# Altium schematic sheet Fsociety_Keyboard_SCH_Cherry.SchDoc: NEW DESIGN
size A2; CompanyName: Rena Electronica; Engineer: IK; Organization: Rena Electronica; Address1: de Ambachten 12; Address2: 4881 XZ; Address3: Zundert; Address4: the Netherlands; DocumentNumber: 05.xxx; Revision: 0.10; Customer: Klantnaam; PageSetup: Record=PageOptions|CenterHorizontal=True|CenterVertical=True|PrintScale=0.73|XCorrection=1.00|YCorrection=1.00|PrintKind=0|BorderSize=5000000|LeftOffset=0|BottomOffset=0|Orientation=2|PaperLength=1000|PaperWidth=1000|Scale=100|PaperSource=7|PrintQuality=-3|MediaType=1|DitherType=10|PrintScaleMode=1|PaperKind=A3|PaperIndex=8; ProjectName: R_NAAM.PRJ
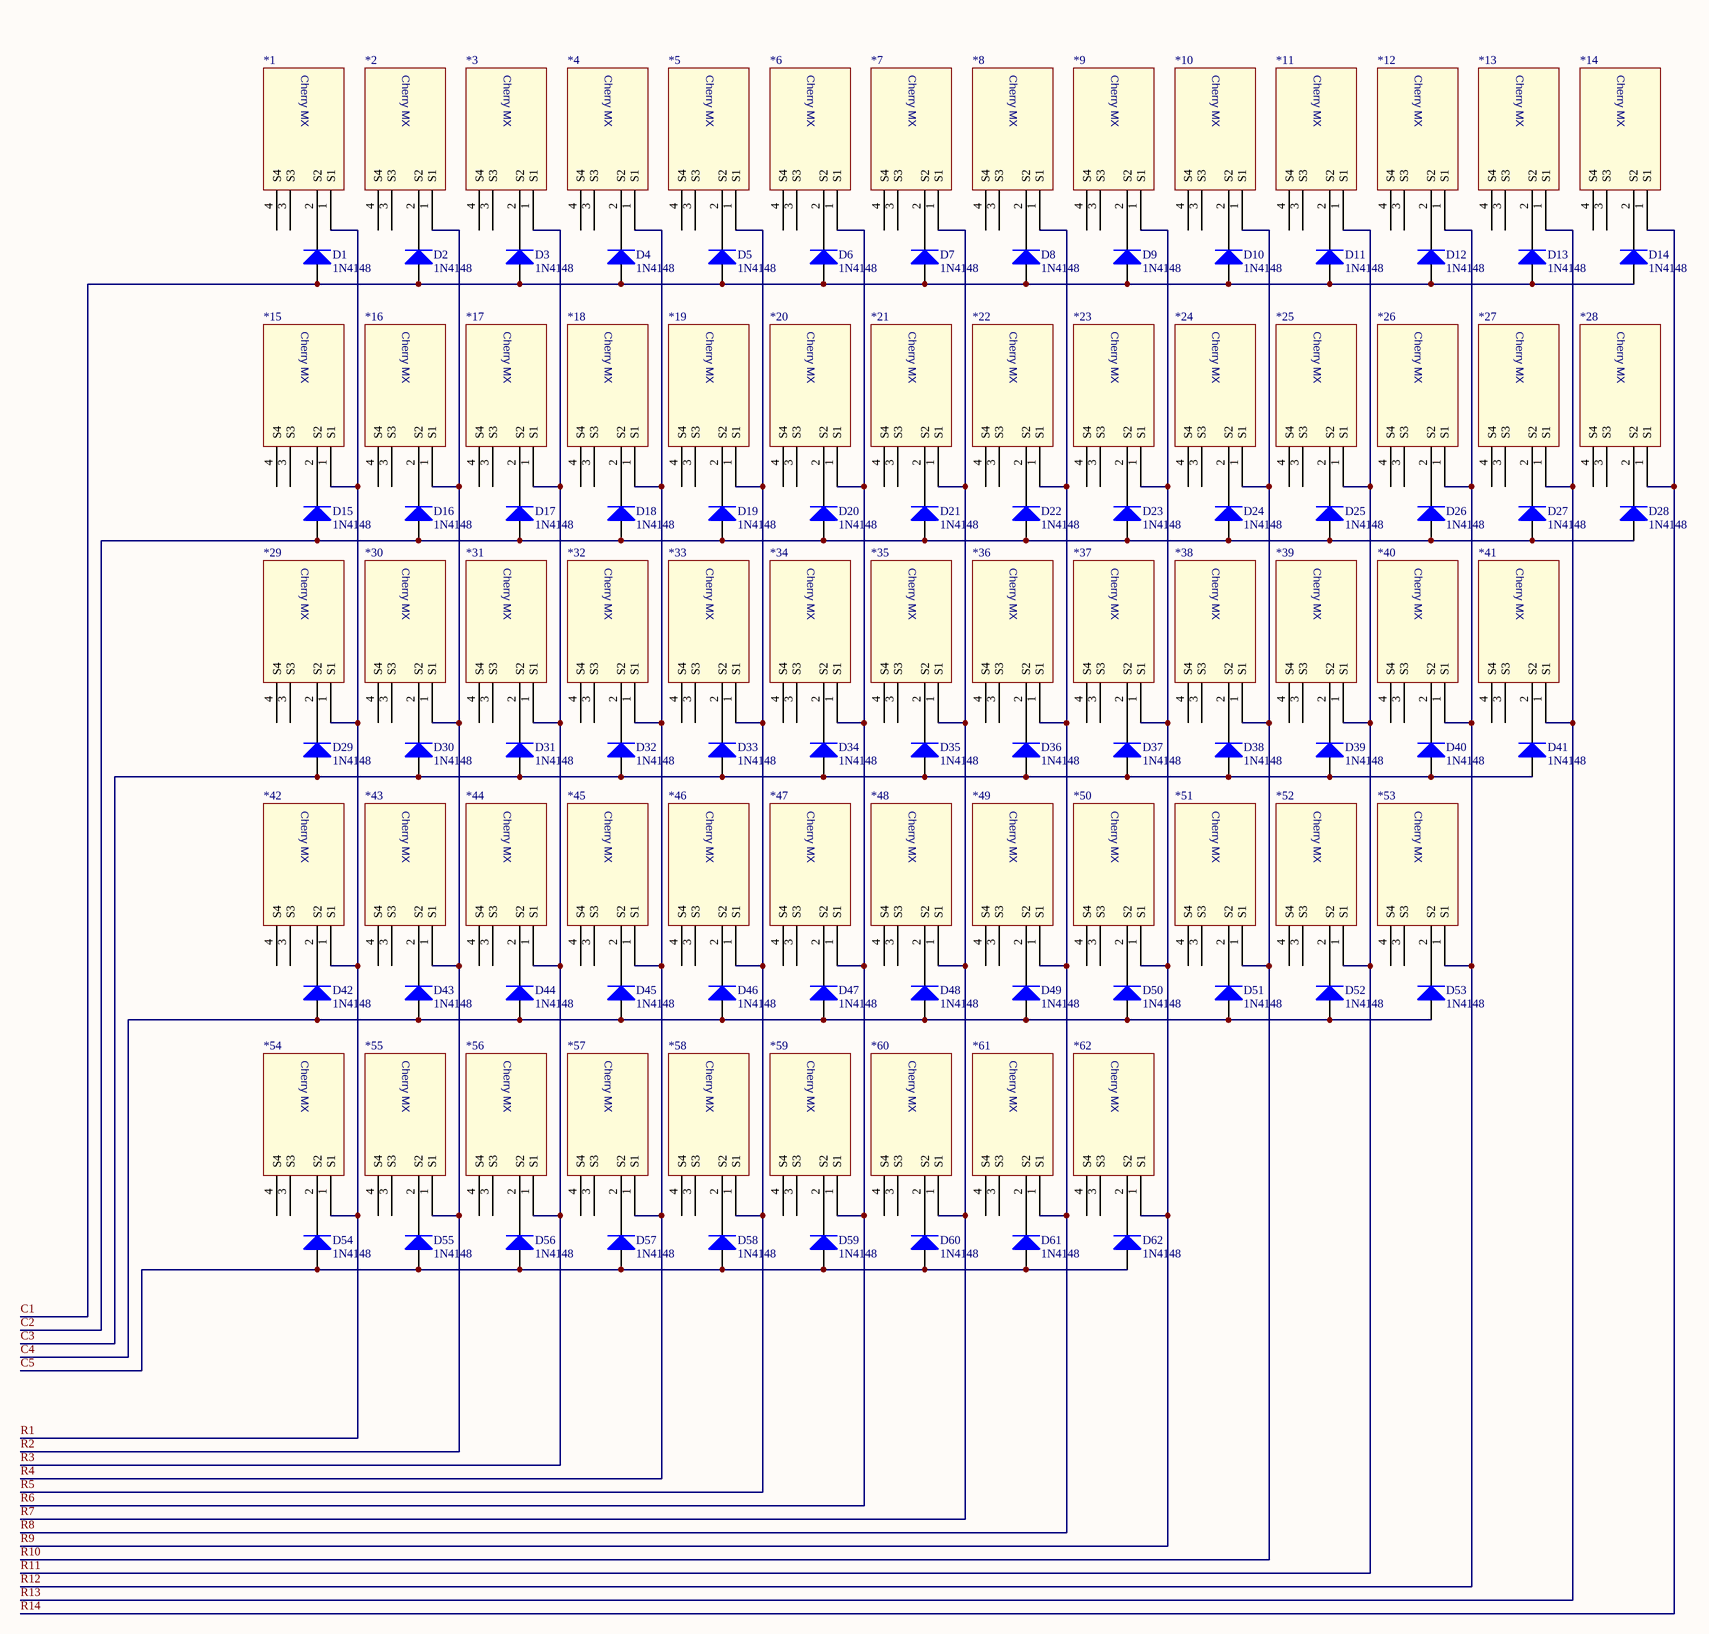
[diagram p0: Fsociety_Keyboard_SCH_Cherry.SchDoc]

## Parts
*1  CHERRY_MX  [CherryMX]  (value not drawn)
*2  CHERRY_MX  [CherryMX]  (value not drawn)
*3  CHERRY_MX  [CherryMX]  (value not drawn)
*4  CHERRY_MX  [CherryMX]  (value not drawn)
*5  CHERRY_MX  [CherryMX]  (value not drawn)
*6  CHERRY_MX  [CherryMX]  (value not drawn)
*7  CHERRY_MX  [CherryMX]  (value not drawn)
*8  CHERRY_MX  [CherryMX]  (value not drawn)
*9  CHERRY_MX  [CherryMX]  (value not drawn)
*10  CHERRY_MX  [CherryMX]  (value not drawn)
*11  CHERRY_MX  [CherryMX]  (value not drawn)
*12  CHERRY_MX  [CherryMX]  (value not drawn)
*13  CHERRY_MX  [CherryMX]  (value not drawn)
*14  CHERRY_MX  [CherryMX]  (value not drawn)
*15  CHERRY_MX  [CherryMX]  (value not drawn)
*16  CHERRY_MX  [CherryMX]  (value not drawn)
*17  CHERRY_MX  [CherryMX]  (value not drawn)
*18  CHERRY_MX  [CherryMX]  (value not drawn)
*19  CHERRY_MX  [CherryMX]  (value not drawn)
*20  CHERRY_MX  [CherryMX]  (value not drawn)
*21  CHERRY_MX  [CherryMX]  (value not drawn)
*22  CHERRY_MX  [CherryMX]  (value not drawn)
*23  CHERRY_MX  [CherryMX]  (value not drawn)
*24  CHERRY_MX  [CherryMX]  (value not drawn)
*25  CHERRY_MX  [CherryMX]  (value not drawn)
*26  CHERRY_MX  [CherryMX]  (value not drawn)
*27  CHERRY_MX  [CherryMX]  (value not drawn)
*28  CHERRY_MX  [CherryMX]  (value not drawn)
*29  CHERRY_MX  [CherryMX]  (value not drawn)
*30  CHERRY_MX  [CherryMX]  (value not drawn)
*31  CHERRY_MX  [CherryMX]  (value not drawn)
*32  CHERRY_MX  [CherryMX]  (value not drawn)
*33  CHERRY_MX  [CherryMX]  (value not drawn)
*34  CHERRY_MX  [CherryMX]  (value not drawn)
*35  CHERRY_MX  [CherryMX]  (value not drawn)
*36  CHERRY_MX  [CherryMX]  (value not drawn)
*37  CHERRY_MX  [CherryMX]  (value not drawn)
*38  CHERRY_MX  [CherryMX]  (value not drawn)
*39  CHERRY_MX  [CherryMX]  (value not drawn)
*40  CHERRY_MX  [CherryMX]  (value not drawn)
*41  CHERRY_MX  [CherryMX]  (value not drawn)
*42  CHERRY_MX  [CherryMX]  (value not drawn)
*43  CHERRY_MX  [CherryMX]  (value not drawn)
*44  CHERRY_MX  [CherryMX]  (value not drawn)
*45  CHERRY_MX  [CherryMX]  (value not drawn)
*46  CHERRY_MX  [CherryMX]  (value not drawn)
*47  CHERRY_MX  [CherryMX]  (value not drawn)
*48  CHERRY_MX  [CherryMX]  (value not drawn)
*49  CHERRY_MX  [CherryMX]  (value not drawn)
*50  CHERRY_MX  [CherryMX]  (value not drawn)
*51  CHERRY_MX  [CherryMX]  (value not drawn)
*52  CHERRY_MX  [CherryMX]  (value not drawn)
*53  CHERRY_MX  [CherryMX]  (value not drawn)
*54  CHERRY_MX  [CherryMX]  (value not drawn)
*55  CHERRY_MX  [CherryMX]  (value not drawn)
*56  CHERRY_MX  [CherryMX]  (value not drawn)
*57  CHERRY_MX  [CherryMX]  (value not drawn)
*58  CHERRY_MX  [CherryMX]  (value not drawn)
*59  CHERRY_MX  [CherryMX]  (value not drawn)
*60  CHERRY_MX  [CherryMX]  (value not drawn)
*61  CHERRY_MX  [CherryMX]  (value not drawn)
*62  CHERRY_MX  [CherryMX]  (value not drawn)
D1  1N4148  [DIOMELF3515_NR_SOD80C]
D2  1N4148  [DIOMELF3515_NR_SOD80C]
D3  1N4148  [DIOMELF3515_NR_SOD80C]
D4  1N4148  [DIOMELF3515_NR_SOD80C]
D5  1N4148  [DIOMELF3515_NR_SOD80C]
D6  1N4148  [DIOMELF3515_NR_SOD80C]
D7  1N4148  [DIOMELF3515_NR_SOD80C]
D8  1N4148  [DIOMELF3515_NR_SOD80C]
D9  1N4148  [DIOMELF3515_NR_SOD80C]
D10  1N4148  [DIOMELF3515_NR_SOD80C]
D11  1N4148  [DIOMELF3515_NR_SOD80C]
D12  1N4148  [DIOMELF3515_NR_SOD80C]
D13  1N4148  [DIOMELF3515_NR_SOD80C]
D14  1N4148  [DIOMELF3515_NR_SOD80C]
D15  1N4148  [DIOMELF3515_NR_SOD80C]
D16  1N4148  [DIOMELF3515_NR_SOD80C]
D17  1N4148  [DIOMELF3515_NR_SOD80C]
D18  1N4148  [DIOMELF3515_NR_SOD80C]
D19  1N4148  [DIOMELF3515_NR_SOD80C]
D20  1N4148  [DIOMELF3515_NR_SOD80C]
D21  1N4148  [DIOMELF3515_NR_SOD80C]
D22  1N4148  [DIOMELF3515_NR_SOD80C]
D23  1N4148  [DIOMELF3515_NR_SOD80C]
D24  1N4148  [DIOMELF3515_NR_SOD80C]
D25  1N4148  [DIOMELF3515_NR_SOD80C]
D26  1N4148  [DIOMELF3515_NR_SOD80C]
D27  1N4148  [DIOMELF3515_NR_SOD80C]
D28  1N4148  [DIOMELF3515_NR_SOD80C]
D29  1N4148  [DIOMELF3515_NR_SOD80C]
D30  1N4148  [DIOMELF3515_NR_SOD80C]
D31  1N4148  [DIOMELF3515_NR_SOD80C]
D32  1N4148  [DIOMELF3515_NR_SOD80C]
D33  1N4148  [DIOMELF3515_NR_SOD80C]
D34  1N4148  [DIOMELF3515_NR_SOD80C]
D35  1N4148  [DIOMELF3515_NR_SOD80C]
D36  1N4148  [DIOMELF3515_NR_SOD80C]
D37  1N4148  [DIOMELF3515_NR_SOD80C]
D38  1N4148  [DIOMELF3515_NR_SOD80C]
D39  1N4148  [DIOMELF3515_NR_SOD80C]
D40  1N4148  [DIOMELF3515_NR_SOD80C]
D41  1N4148  [DIOMELF3515_NR_SOD80C]
D42  1N4148  [DIOMELF3515_NR_SOD80C]
D43  1N4148  [DIOMELF3515_NR_SOD80C]
D44  1N4148  [DIOMELF3515_NR_SOD80C]
D45  1N4148  [DIOMELF3515_NR_SOD80C]
D46  1N4148  [DIOMELF3515_NR_SOD80C]
D47  1N4148  [DIOMELF3515_NR_SOD80C]
D48  1N4148  [DIOMELF3515_NR_SOD80C]
D49  1N4148  [DIOMELF3515_NR_SOD80C]
D50  1N4148  [DIOMELF3515_NR_SOD80C]
D51  1N4148  [DIOMELF3515_NR_SOD80C]
D52  1N4148  [DIOMELF3515_NR_SOD80C]
D53  1N4148  [DIOMELF3515_NR_SOD80C]
D54  1N4148  [DIOMELF3515_NR_SOD80C]
D55  1N4148  [DIOMELF3515_NR_SOD80C]
D56  1N4148  [DIOMELF3515_NR_SOD80C]
D57  1N4148  [DIOMELF3515_NR_SOD80C]
D58  1N4148  [DIOMELF3515_NR_SOD80C]
D59  1N4148  [DIOMELF3515_NR_SOD80C]
D60  1N4148  [DIOMELF3515_NR_SOD80C]
D61  1N4148  [DIOMELF3515_NR_SOD80C]
D62  1N4148  [DIOMELF3515_NR_SOD80C]

## Nets
C1: D1.A D2.A D3.A D4.A D5.A D6.A D7.A D8.A D9.A D10.A D11.A D12.A D13.A D14.A
C2: D15.A D16.A D17.A D18.A D19.A D20.A D21.A D22.A D23.A D24.A D25.A D26.A D27.A D28.A
C3: D29.A D30.A D31.A D32.A D33.A D34.A D35.A D36.A D37.A D38.A D39.A D40.A D41.A
C4: D42.A D43.A D44.A D45.A D46.A D47.A D48.A D49.A D50.A D51.A D52.A D53.A
C5: D54.A D55.A D56.A D57.A D58.A D59.A D60.A D61.A D62.A
R1: *1.1(S1) *15.1(S1) *29.1(S1) *42.1(S1) *54.1(S1)
R2: *2.1(S1) *16.1(S1) *30.1(S1) *43.1(S1) *55.1(S1)
R3: *3.1(S1) *17.1(S1) *31.1(S1) *44.1(S1) *56.1(S1)
R4: *4.1(S1) *18.1(S1) *32.1(S1) *45.1(S1) *57.1(S1)
R5: *5.1(S1) *19.1(S1) *33.1(S1) *46.1(S1) *58.1(S1)
R6: *6.1(S1) *20.1(S1) *34.1(S1) *47.1(S1) *59.1(S1)
R7: *7.1(S1) *21.1(S1) *35.1(S1) *48.1(S1) *60.1(S1)
R8: *8.1(S1) *22.1(S1) *36.1(S1) *49.1(S1) *61.1(S1)
R9: *9.1(S1) *23.1(S1) *37.1(S1) *50.1(S1) *62.1(S1)
R10: *10.1(S1) *24.1(S1) *38.1(S1) *51.1(S1)
R11: *11.1(S1) *25.1(S1) *39.1(S1) *52.1(S1)
R12: *12.1(S1) *26.1(S1) *40.1(S1) *53.1(S1)
R13: *13.1(S1) *27.1(S1) *41.1(S1)
R14: *14.1(S1) *28.1(S1)
Net*1_2: *1.2(S2) D1.C
Net*2_2: *2.2(S2) D2.C
Net*3_2: *3.2(S2) D3.C
Net*4_2: *4.2(S2) D4.C
Net*5_2: *5.2(S2) D5.C
Net*6_2: *6.2(S2) D6.C
Net*7_2: *7.2(S2) D7.C
Net*8_2: *8.2(S2) D8.C
Net*9_2: *9.2(S2) D9.C
Net*10_2: *10.2(S2) D10.C
Net*11_2: *11.2(S2) D11.C
Net*12_2: *12.2(S2) D12.C
Net*13_2: *13.2(S2) D13.C
Net*14_2: *14.2(S2) D14.C
Net*15_2: *15.2(S2) D15.C
Net*16_2: *16.2(S2) D16.C
Net*17_2: *17.2(S2) D17.C
Net*18_2: *18.2(S2) D18.C
Net*19_2: *19.2(S2) D19.C
Net*20_2: *20.2(S2) D20.C
Net*21_2: *21.2(S2) D21.C
Net*22_2: *22.2(S2) D22.C
Net*23_2: *23.2(S2) D23.C
Net*24_2: *24.2(S2) D24.C
Net*25_2: *25.2(S2) D25.C
Net*26_2: *26.2(S2) D26.C
Net*27_2: *27.2(S2) D27.C
Net*28_2: *28.2(S2) D28.C
Net*29_2: *29.2(S2) D29.C
Net*30_2: *30.2(S2) D30.C
Net*31_2: *31.2(S2) D31.C
Net*32_2: *32.2(S2) D32.C
Net*33_2: *33.2(S2) D33.C
Net*34_2: *34.2(S2) D34.C
Net*35_2: *35.2(S2) D35.C
Net*36_2: *36.2(S2) D36.C
Net*37_2: *37.2(S2) D37.C
Net*38_2: *38.2(S2) D38.C
Net*39_2: *39.2(S2) D39.C
Net*40_2: *40.2(S2) D40.C
Net*41_2: *41.2(S2) D41.C
Net*42_2: *42.2(S2) D42.C
Net*43_2: *43.2(S2) D43.C
Net*44_2: *44.2(S2) D44.C
Net*45_2: *45.2(S2) D45.C
Net*46_2: *46.2(S2) D46.C
Net*47_2: *47.2(S2) D47.C
Net*48_2: *48.2(S2) D48.C
Net*49_2: *49.2(S2) D49.C
Net*50_2: *50.2(S2) D50.C
Net*51_2: *51.2(S2) D51.C
Net*52_2: *52.2(S2) D52.C
Net*53_2: *53.2(S2) D53.C
Net*54_2: *54.2(S2) D54.C
Net*55_2: *55.2(S2) D55.C
Net*56_2: *56.2(S2) D56.C
Net*57_2: *57.2(S2) D57.C
Net*58_2: *58.2(S2) D58.C
Net*59_2: *59.2(S2) D59.C
Net*60_2: *60.2(S2) D60.C
Net*61_2: *61.2(S2) D61.C
Net*62_2: *62.2(S2) D62.C

Not connected (* = marked no-connect by the designer): *1 3(S3) 4(S4); *2 3(S3) 4(S4); *3 3(S3) 4(S4); *4 3(S3) 4(S4); *5 3(S3) 4(S4); *6 3(S3) 4(S4); *7 3(S3) 4(S4); *8 3(S3) 4(S4); *9 3(S3) 4(S4); *10 3(S3) 4(S4); *11 3(S3) 4(S4); *12 3(S3) 4(S4); *13 3(S3) 4(S4); *14 3(S3) 4(S4); *15 3(S3) 4(S4); *16 3(S3) 4(S4); *17 3(S3) 4(S4); *18 3(S3) 4(S4); *19 3(S3) 4(S4); *20 3(S3) 4(S4); *21 3(S3) 4(S4); *22 3(S3) 4(S4); *23 3(S3) 4(S4); *24 3(S3) 4(S4); *25 3(S3) 4(S4); *26 3(S3) 4(S4); *27 3(S3) 4(S4); *28 3(S3) 4(S4); *29 3(S3) 4(S4); *30 3(S3) 4(S4); *31 3(S3) 4(S4); *32 3(S3) 4(S4); *33 3(S3) 4(S4); *34 3(S3) 4(S4); *35 3(S3) 4(S4); *36 3(S3) 4(S4); *37 3(S3) 4(S4); *38 3(S3) 4(S4); *39 3(S3) 4(S4); *40 3(S3) 4(S4); *41 3(S3) 4(S4); *42 3(S3) 4(S4); *43 3(S3) 4(S4); *44 3(S3) 4(S4); *45 3(S3) 4(S4); *46 3(S3) 4(S4); *47 3(S3) 4(S4); *48 3(S3) 4(S4); *49 3(S3) 4(S4); *50 3(S3) 4(S4); *51 3(S3) 4(S4); *52 3(S3) 4(S4); *53 3(S3) 4(S4); *54 3(S3) 4(S4); *55 3(S3) 4(S4); *56 3(S3) 4(S4); *57 3(S3) 4(S4); *58 3(S3) 4(S4); *59 3(S3) 4(S4); *60 3(S3) 4(S4); *61 3(S3) 4(S4); *62 3(S3) 4(S4)

## Notes on the sheet
- (in symbol CHERRY_MX) Cherry MX

## Library data of the parts
D1-D62 = CMP-00137-A.4: Diode 1N4148 SOD80(SMT); MAXPartNumber: 1N4148!; PartNumber: LL4148-GS18-LF; Manufacturer: Vishay; IFSM Max (A): 0.5; Packing: Tape en Reel; Type: Fast; Reverse Voltage: 100V; Forward Voltage: ? V; IF (Cont): ? A; ComponentLink1Description: Manufacturer URL; ComponentLink1URL: http://www.vishay.com/; ComponentLink2Description: Datasheet; ComponentLink2URL: http://www.vishay.com/docs/85557/ll4148.pdf; ComponentLink3Description: Package Specification; ComponentLink3URL: http://www.vishay.com/docs/85557/ll4148.pdf; Mounting Technology: Surface Mount; PackageDescription: Melf Diode; PackageReference: SOD80; RoHS: TRUE; FLS_PN: 1N4148!; RENA_PN: 1N4148!; IF (Max): ? A